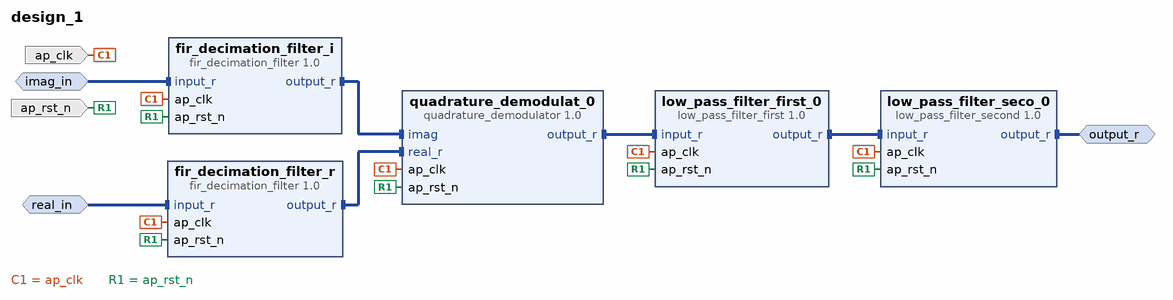
[diagram p0: block diagram of the top level]
# Vivado block design design_1, xc7z020clg400-1, Vivado 2022.1
create_bd_design design_1

create_bd_intf_port -mode Slave -vlnv xilinx.com:interface:axis_rtl:1.0 imag_in
set_property -dict [list \
  CONFIG.HAS_TKEEP 1 \
  CONFIG.HAS_TLAST 1 \
  CONFIG.HAS_TREADY 1 \
  CONFIG.HAS_TSTRB 1 \
  CONFIG.LAYERED_METADATA undef \
  CONFIG.TDATA_NUM_BYTES 1 \
  CONFIG.TDEST_WIDTH 0 \
  CONFIG.TID_WIDTH 0 \
  CONFIG.TUSER_WIDTH 0 \
] [get_bd_intf_ports imag_in]
create_bd_intf_port -mode Slave -vlnv xilinx.com:interface:axis_rtl:1.0 real_in
set_property -dict [list \
  CONFIG.HAS_TKEEP 1 \
  CONFIG.HAS_TLAST 1 \
  CONFIG.HAS_TREADY 1 \
  CONFIG.HAS_TSTRB 1 \
  CONFIG.LAYERED_METADATA undef \
  CONFIG.TDATA_NUM_BYTES 1 \
  CONFIG.TDEST_WIDTH 0 \
  CONFIG.TID_WIDTH 0 \
  CONFIG.TUSER_WIDTH 0 \
] [get_bd_intf_ports real_in]
create_bd_intf_port -mode Master -vlnv xilinx.com:interface:axis_rtl:1.0 output_r
create_bd_port -dir I -type clk ap_clk
set_property -dict {CONFIG.FREQ_HZ 100000000} [get_bd_ports ap_clk]
create_bd_port -dir I -type rst ap_rst_n

create_bd_cell -type ip -vlnv xilinx.com:hls:fir_decimation_filter:1.0 fir_decimation_filter_r
create_bd_cell -type ip -vlnv xilinx.com:hls:quadrature_demodulator:1.0 quadrature_demodulat_0
create_bd_cell -type ip -vlnv xilinx.com:hls:low_pass_filter_first:1.0 low_pass_filter_first_0
create_bd_cell -type ip -vlnv xilinx.com:hls:low_pass_filter_second:1.0 low_pass_filter_seco_0
create_bd_cell -type ip -vlnv xilinx.com:hls:fir_decimation_filter:1.0 fir_decimation_filter_i

# ---- connections ----

connect_bd_intf_net -intf_net fir_decimation_filter_0_output_r [get_bd_intf_pins fir_decimation_filter_r/output_r] [get_bd_intf_pins quadrature_demodulat_0/real_r]
connect_bd_intf_net -intf_net fir_decimation_filter_1_output_r [get_bd_intf_pins fir_decimation_filter_i/output_r] [get_bd_intf_pins quadrature_demodulat_0/imag]
connect_bd_intf_net -intf_net input_r_0_1 [get_bd_intf_ports imag_in] [get_bd_intf_pins fir_decimation_filter_i/input_r]
connect_bd_intf_net -intf_net input_r_1_1 [get_bd_intf_ports real_in] [get_bd_intf_pins fir_decimation_filter_r/input_r]
connect_bd_intf_net [get_bd_intf_pins low_pass_filter_first_0/output_r] [get_bd_intf_pins low_pass_filter_seco_0/input_r]
connect_bd_intf_net [get_bd_intf_ports output_r] [get_bd_intf_pins low_pass_filter_seco_0/output_r]
connect_bd_intf_net [get_bd_intf_pins quadrature_demodulat_0/output_r] [get_bd_intf_pins low_pass_filter_first_0/input_r]
connect_bd_net -net ps7_0_FCLK_CLK0 [get_bd_ports ap_clk] \
  [get_bd_pins low_pass_filter_first_0/ap_clk] [get_bd_pins quadrature_demodulat_0/ap_clk] \
  [get_bd_pins low_pass_filter_seco_0/ap_clk] [get_bd_pins fir_decimation_filter_r/ap_clk] \
  [get_bd_pins fir_decimation_filter_i/ap_clk]
connect_bd_net -net rst_ps7_0_fclk0_peripheral_aresetn [get_bd_ports ap_rst_n] \
  [get_bd_pins low_pass_filter_first_0/ap_rst_n] [get_bd_pins quadrature_demodulat_0/ap_rst_n] \
  [get_bd_pins low_pass_filter_seco_0/ap_rst_n] [get_bd_pins fir_decimation_filter_i/ap_rst_n] \
  [get_bd_pins fir_decimation_filter_r/ap_rst_n]

validate_bd_design
save_bd_design
